# Altium schematic sheet Power - Input.SchDoc
size A; SheetNumber: 3; SheetTotal: 11
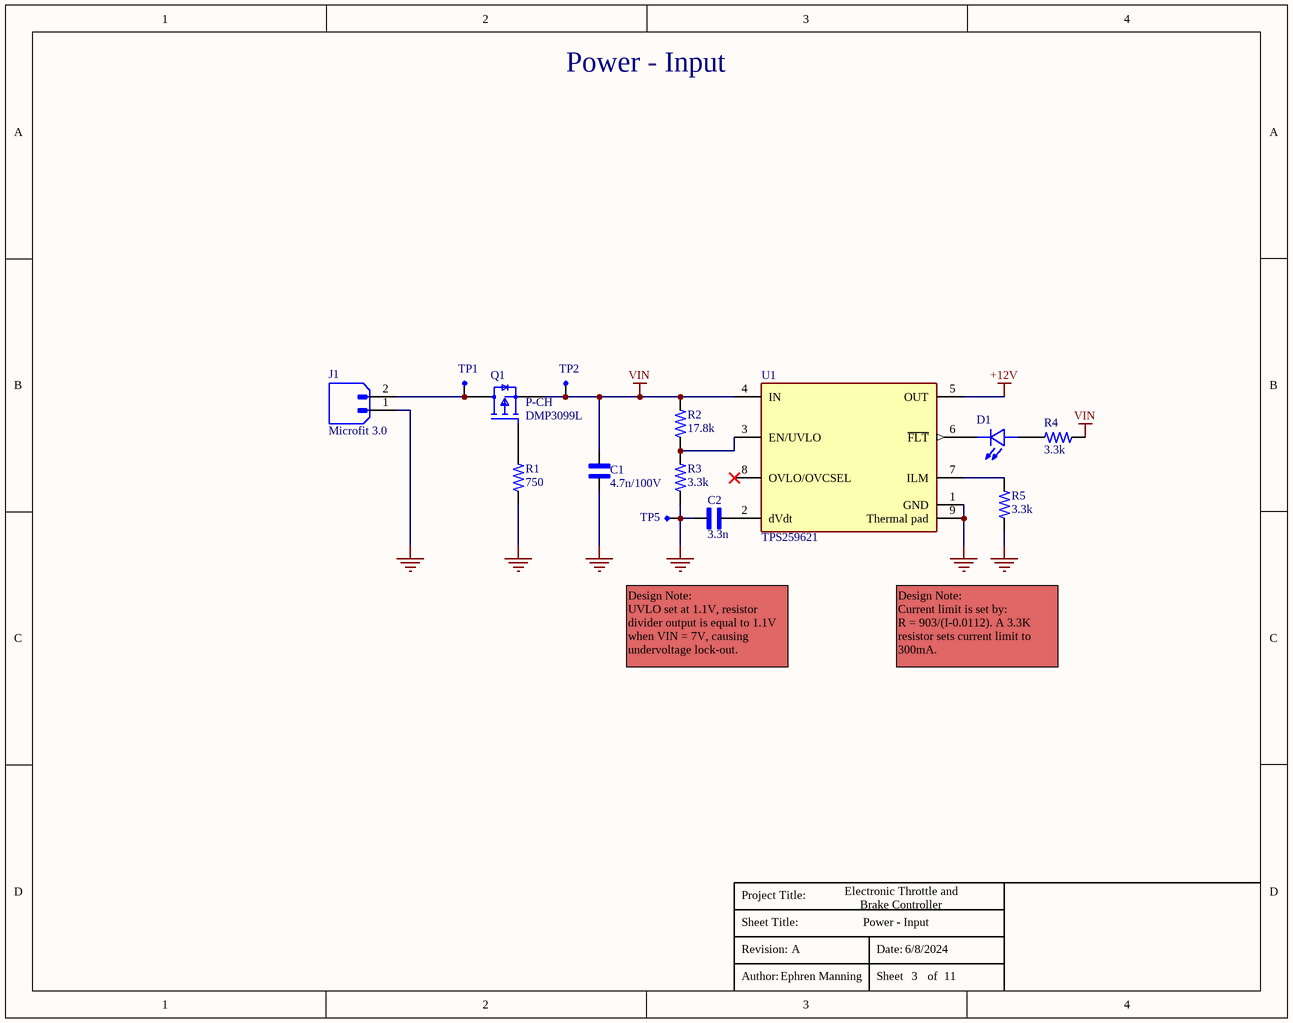
[diagram p0: Power - Input.SchDoc]

## Parts
C1  4.7n/100V  [CAP_0402-Footprint-1]
C2  3.3n  [CAP_0402-Footprint-1]
D1  150060RS75000  [LED_150060RS75000]  (value not drawn)
J1  Microfit 3.0  [MOLEX_436500216]
Q1  DMP3099L  [SOT95P242X110-3N]
R1  750  [RES_0402-Footprint-1]
R2  17.8k  [RES_0402-Footprint-1]
R3  3.3k  [RES_0402-Footprint-1]
R4  3.3k  [RES_0402-Footprint-1]
R5  3.3k  [RES_0402-Footprint-1]
TP1  SMD Testpoint  [SMD Testpoint-Footprint-1]  (value not drawn)
TP2  SMD Testpoint  [SMD Testpoint-Footprint-1]  (value not drawn)
TP5  SMD Testpoint  [SMD Testpoint-Footprint-1]  (value not drawn)
U1  TPS259621  [FP-DDA0008E-IPC_B]

## Nets
+12V: U1.5(OUT)
GND: C1.1 C2.1 J1.1 R1.1 R3.1 R5.1 TP5.1 U1.1(GND) U1.9(Thermal_pad)
VIN: C1.2 Q1.2(Source) R2.2 R4.1 TP2.1 U1.4(IN)
NetC2_2: C2.2 U1.2(dVdt)
NetD1_A: D1.A R4.2
NetD1_C: D1.C U1.6(~{FLT})
NetJ1_2: J1.2 Q1.3(Drain) TP1.1
NetQ1_1: Q1.1(Gate) R1.2
NetR2_1: R2.1 R3.2 U1.3(EN/UVLO)
NetR5_2: R5.2 U1.7(ILM)

Not connected (* = marked no-connect by the designer): U1 8(OVLO/OVCSEL)*

## Notes on the sheet
- Power - Input
- (near Q1) P-CH
- Design Note:
  UVLO set at 1.1V, resistor divider output is equal to 1.1V when VIN = 7V, causing undervoltage lock-out.
- Design Note:
  Current limit is set by:
  R = 903/(I-0.0112). A 3.3K resistor sets current limit to 300mA.
- Electronic Throttle and
  Brake Controller
- A
- 6/8/2024
- Ephren Manning
- 3
- 11
- Project Title:
- Sheet Title:
- Revision:
- Date:
- Author:
- Sheet        of

## Library data of the parts
C1 = CMP-00072-1: 4.7nF 100V 10% 0402 Ceramic Capacitor; Manufacturer 1: Murata Electronics; Manufacturer Part Number 1: GCM155R72A472KA37D; Digikey Part Number: 490-4765-1-ND
C2 = CMP-00088-1: 3.3nF 25V 0402 Ceramic Capacitor; Manufacturer 1: YAGEO; Manufacturer Part Number 1: CC0402KRX7R8BB332; Digikey Part Number: 311-3623-1-ND
D1 = CMP-120-000000-3: CLEAR RED LEAD 0603 2V Forward Voltage; Manufacturer 1: Würth Elektronik; Manufacturer Part Number 1: 150060RS75000; Digikey Part Number: 732-4978-1-ND
J1 = CMP-085-000002-2: 1x2 Gold Microfit; Manufacturer Part Number 1: 43650-0216; Manufacturer 1: Molex; Digikey Part Number: WM1922-ND
Q1 = CMP-00025-2: Mosfet P-CH 30V 3.8A Vgs(ON) = -10V SOT23; Manufacturer Part Number 1: DMP3099L-7; Manufacturer 1: Diodes Incorporated; Digikey Part Number: DMP3099L-7DICT-ND
R1 = CMP-00078-1: 750 1% 1/16W 0402 Thick Film; Manufacturer Part Number 1: RC0402FR-07750RL; Manufacturer 1: YAGEO; Digikey Part Number: 311-750LRCT-ND
R2 = CMP-00090-1: 17.8k 1% 1/16W 0402 Thick Film; Manufacturer 1: YAGEO; Manufacturer Part Number 1: RC0402FR-0717K8L; Digikey Part Number: YAG3012CT-ND
R3-R5 = CMP-00091-1: 3.3k 1% 1/16W 0402 Thick Film; Manufacturer 1: YAGEO; Manufacturer Part Number 1: RC0402FR-073K3L; Digikey Part Number: 311-3.30KLRCT-ND
TP1 TP2 TP5 = CMP-00095-4: Flat 50x50mil Test Point
U1 = CMP-00086-2: 19V 2A EFUSE; Manufacturer 1: Texas Instruments; Manufacturer Part Number 1: TPS259621DDAT; Digikey Part Number: 296-TPS259621DDATCT-ND